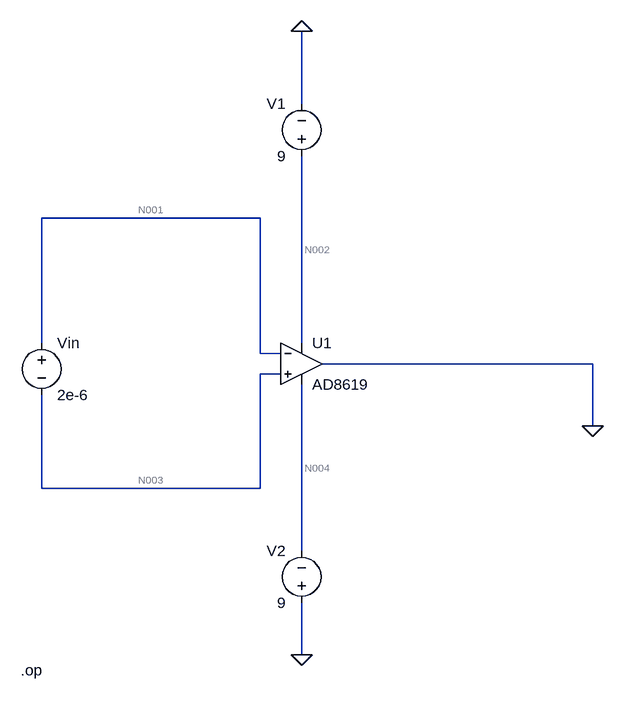
[diagram p0: schematic Circuit 4.asc]
Circuit 4.asc, the LTspice schematic file:
Version 4
SHEET 1 1448 680
WIRE 144 -352 144 -464
WIRE 80 -176 -256 -176
WIRE -256 16 -256 -176
WIRE 144 16 144 -272
WIRE 80 32 80 -176
WIRE 112 32 80 32
WIRE 592 48 176 48
WIRE 112 64 80 64
WIRE 592 144 592 48
WIRE -256 240 -256 96
WIRE 80 240 80 64
WIRE 80 240 -256 240
WIRE 144 336 144 80
WIRE 144 496 144 416
FLAG 144 -464 0
FLAG 144 496 0
FLAG 592 144 0
SYMBOL OpAmps\\AD8619 144 -16 R0
SYMATTR InstName U1
SYMBOL voltage -256 0 R0
WINDOW 123 0 0 Left 0
WINDOW 39 0 0 Left 0
SYMATTR InstName Vin
SYMATTR Value 2e-6
SYMBOL voltage 144 -256 R180
WINDOW 0 24 96 Left 2
WINDOW 3 24 16 Left 2
WINDOW 123 0 0 Left 0
WINDOW 39 0 0 Left 0
SYMATTR InstName V1
SYMATTR Value 9
SYMBOL voltage 144 432 R180
WINDOW 0 24 96 Left 2
WINDOW 3 24 16 Left 2
WINDOW 123 0 0 Left 0
WINDOW 39 0 0 Left 0
SYMATTR InstName V2
SYMATTR Value 9
TEXT -288 520 Left 2 !.op

The netlist it stands for:
* Circuit 4.asc
XU1 N003 N001 N002 N004 0 AD8619  ; pins In+ In- V+ V- OUT
Vin N001 N003 2e-6
V1 N002 0 9
V2 0 N004 9
.op
.backanno
.end

* Results of the author's LTspice run, read from the files saved beside the schematic
* Operating Point:
*   V(n001) = 2 µV
*   V(n004) = -9 V
*   V(n002) = 9 V
*   V(n003) = 0 V
*   I(Vin) = 50 fA
*   I(V1) = -7.336 mA
*   I(V2) = -55.91 µA
*   Ix(u1:1) = 50 fA
*   Ix(u1:2) = -50 fA
*   Ix(u1:99) = 7.336 mA
*   Ix(u1:50) = -55.91 µA
*   Ix(u1:45) = -7.28 mA
* From the log:
*   Semiconductor Device Operating Points:
*                           --- Diodes ---
*   Name:    d:u1:1      d:u1:2      d:u1:3      d:u1:4      d:u1:5
*   Model:    u1:dx       u1:dx       u1:dx       u1:dx     u1:dnoise
*   Id:     -8.22e-12   -8.31e-12   -9.53e-12   -8.89e-12    9.99e-04
*   Vd:     -8.21e+00   -8.30e+00   -9.52e+00   -8.88e+00    6.55e-01
*   Req:     1.00e+12    1.00e+12    1.00e+12    1.00e+12    2.59e+01
*   CAP:     0.00e+00    0.00e+00    0.00e+00    0.00e+00    0.00e+00
*                           --- MOSFET Transistors ---
*   Name:        m:u1:1      m:u1:2      m:u1:3      m:u1:4      m:u1:5
*   Model:       u1:pix      u1:pix      u1:nix      u1:nix      u1:pox
*   Id:         -2.43e-06   -2.57e-06    2.56e-06    2.44e-06   -7.28e-03
*   Vgs:        -5.28e-01   -5.29e-01    5.34e-01    5.33e-01   -1.62e+00
*   Vds:        -9.33e+00   -9.32e+00    9.33e+00    9.34e+00   -9.00e+00
*   Vbs:         0.00e+00    0.00e+00    0.00e+00    0.00e+00    0.00e+00
*   Vth:        -5.00e-01   -5.00e-01    5.00e-01    5.00e-01   -7.00e-01
*   Vdsat:      -2.77e-02   -2.85e-02    3.38e-02    3.30e-02   -9.17e-01
*   Gm:          1.75e-04    1.80e-04    1.51e-04    1.48e-04    1.59e-02
*   Gds:         2.03e-07    2.15e-07    7.09e-08    6.76e-08    5.93e-04
*   Gmb:         0.00e+00    0.00e+00    0.00e+00    0.00e+00    0.00e+00
*   Cbd:         0.00e+00    0.00e+00    0.00e+00    0.00e+00    0.00e+00
*   Cbs:         0.00e+00    0.00e+00    0.00e+00    0.00e+00    0.00e+00
*   Cgsov:       0.00e+00    0.00e+00    0.00e+00    0.00e+00    0.00e+00
*   Cgdov:       0.00e+00    0.00e+00    0.00e+00    0.00e+00    0.00e+00
*   Cgbov:       0.00e+00    0.00e+00    0.00e+00    0.00e+00    0.00e+00
*   Cgs:         5.46e-14    5.46e-14    2.04e-14    2.04e-14    5.76e-14
*   Cgd:         0.00e+00    0.00e+00    0.00e+00    0.00e+00    0.00e+00
*   Cgb:         0.00e+00    0.00e+00    0.00e+00    0.00e+00    0.00e+00
*   Name:        m:u1:6
*   Model:       u1:nox
*   Id:          1.80e-11
*   Vgs:        -2.37e-01
*   Vds:         9.00e+00
*   Vbs:         0.00e+00
*   Vth:         6.00e-01
*   Vdsat:       0.00e+00
*   Gm:          0.00e+00
*   Gds:         0.00e+00
*   Gmb:         0.00e+00
*   Cbd:         0.00e+00
*   Cbs:         0.00e+00
*   Cgsov:       0.00e+00
*   Cgdov:       0.00e+00
*   Cgbov:       0.00e+00
*   Cgs:         0.00e+00
*   Cgd:         0.00e+00
*   Cgb:         6.66e-13